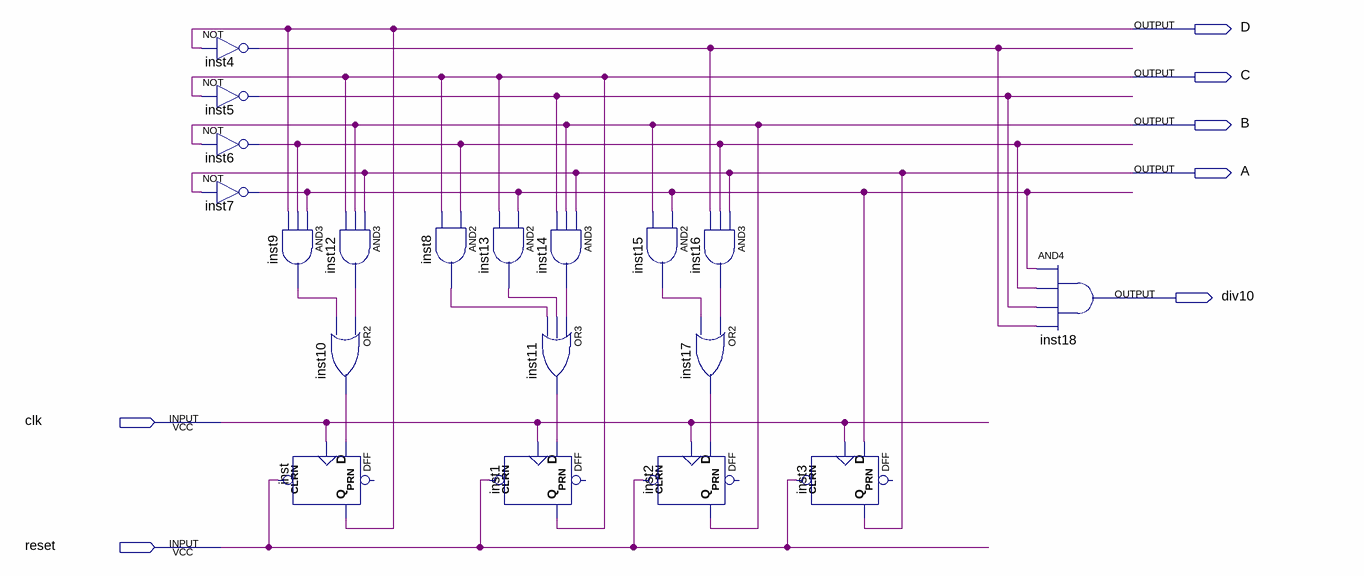
[diagram p0: schematic sheet]
// Quartus schematic div10.bdf as structural Verilog: 19 symbols, 7 pins
module div10 (
  input  clk,
  input  reset,
  output D,
  output C,
  output B,
  output A,
  output div10
);

  wire inst4_out, inst5_out, inst6_out, inst7_out, inst8_out, inst9_out, inst10_out, inst11_out, inst12_out,
       inst13_out, inst14_out, inst15_out, inst16_out, inst17_out;

  not inst4 (inst4_out, D);
  not inst5 (inst5_out, C);
  not inst6 (inst6_out, B);
  not inst7 (inst7_out, A);
  and inst9 (inst9_out, inst7_out, inst6_out, D);
  DFF inst (.CLRN(reset), .CLK(clk), .D(inst10_out), .Q(D));  // open: PRN
  and inst12 (inst12_out, A, B, C);
  or inst10 (inst10_out, inst12_out, inst9_out);
  and inst8 (inst8_out, inst6_out, C);
  and inst13 (inst13_out, inst7_out, C);
  DFF inst1 (.CLRN(reset), .CLK(clk), .D(inst11_out), .Q(C));  // open: PRN
  and inst14 (inst14_out, A, B, inst5_out);
  or inst11 (inst11_out, inst14_out, inst13_out, inst8_out);
  and inst15 (inst15_out, inst7_out, B);
  DFF inst2 (.CLRN(reset), .CLK(clk), .D(inst17_out), .Q(B));  // open: PRN
  and inst16 (inst16_out, A, inst6_out, inst4_out);
  or inst17 (inst17_out, inst16_out, inst15_out);
  DFF inst3 (.CLRN(reset), .CLK(clk), .D(inst7_out), .Q(A));  // open: PRN
  and inst18 (div10, inst7_out, inst6_out, inst5_out, inst4_out);
endmodule
